# Altium schematic sheet SolarConnectors.SchDoc
size A; SheetNumber: 9; SheetTotal: 10
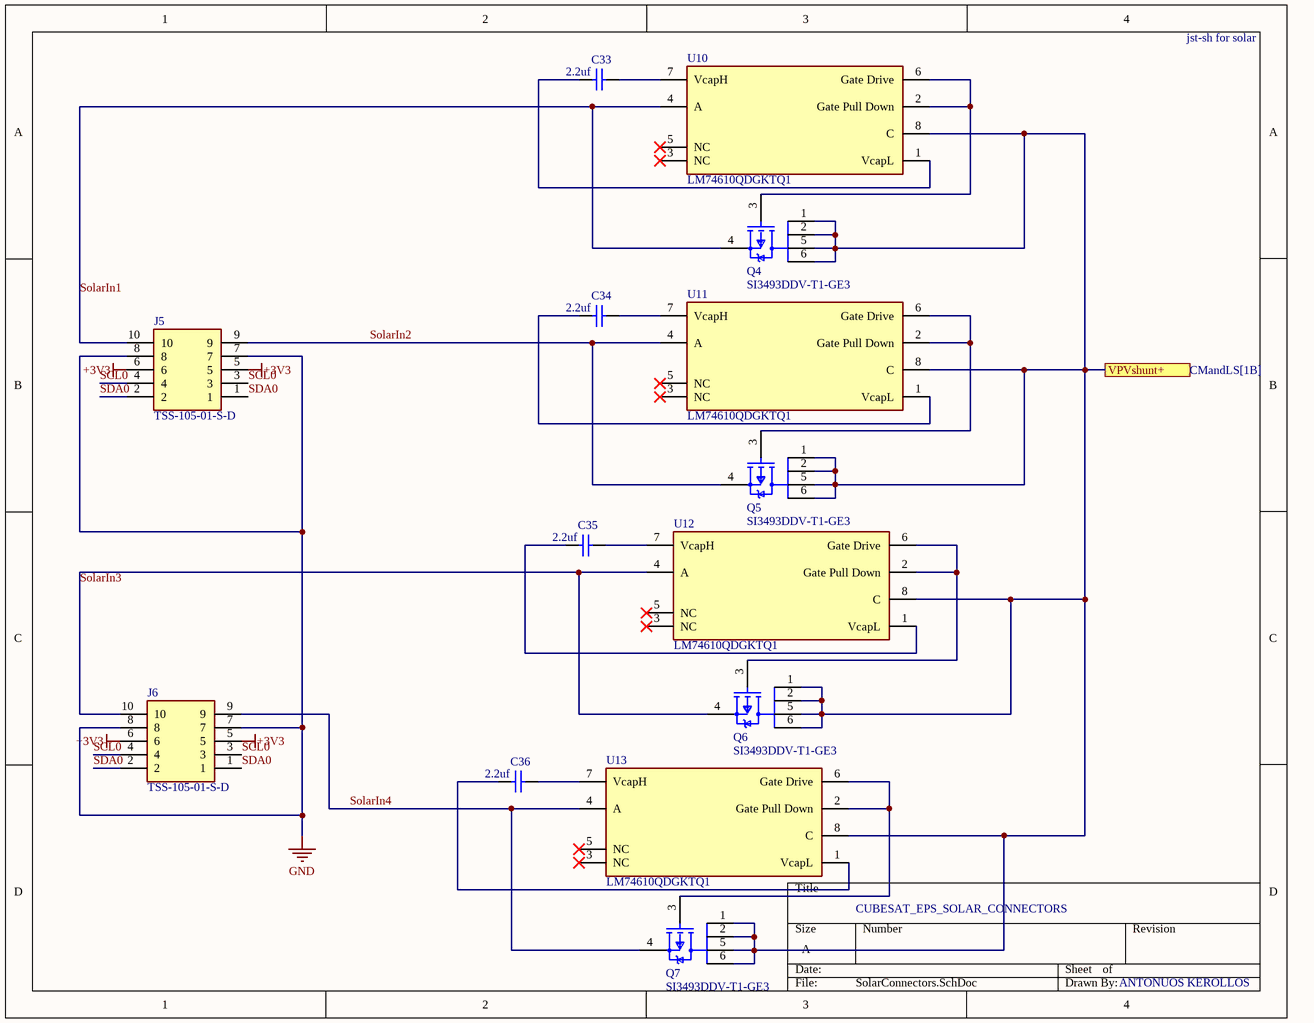
[diagram p0: SolarConnectors.SchDoc]

## Parts
C33  2.2uf  [CAPC2013X145X50ML20T25]
C34  2.2uf  [CAPC2013X145X50ML20T25]
C35  2.2uf  [CAPC2013X145X50ML20T25]
C36  2.2uf  [CAPC2013X145X50ML20T25]
J5  TSS-105-01-S-D  [TSS-105-XX-YYY-D]
J6  TSS-105-01-S-D  [TSS-105-XX-YYY-D]
Q4  SI3493DDV-T1-GE3  [FP-C-06593-MFG]
Q5  SI3493DDV-T1-GE3  [FP-C-06593-MFG]
Q6  SI3493DDV-T1-GE3  [FP-C-06593-MFG]
Q7  SI3493DDV-T1-GE3  [FP-C-06593-MFG]
U10  LM74610QDGKTQ1  [FP-DGK0008A-MFG]
U11  LM74610QDGKTQ1  [FP-DGK0008A-MFG]
U12  LM74610QDGKTQ1  [FP-DGK0008A-MFG]
U13  LM74610QDGKTQ1  [FP-DGK0008A-MFG]

## Ports
VPVshunt+ (see CMandLS[1B])

## Nets
+3V3: J5.5 J5.6 J6.5 J6.6
GND: J5.7 J5.8 J6.7 J6.8
SCL0: J5.3 J5.4 J6.3 J6.4
SDA0: J5.1 J5.2 J6.1 J6.2
SolarIn1: J5.10 Q4.4(S) U10.4(A)
SolarIn2: J5.9 Q5.4(S) U11.4(A)
SolarIn3: J6.10 Q6.4(S) U12.4(A)
SolarIn4: J6.9 Q7.4(S) U13.4(A)
VPVshunt+: Q4.1(D) Q4.2(D) Q4.5(D) Q4.6(D) Q5.1(D) Q5.2(D) Q5.5(D) Q5.6(D) Q6.1(D) Q6.2(D) Q6.5(D) Q6.6(D) Q7.1(D) Q7.2(D) Q7.5(D) Q7.6(D) U10.8(C) U11.8(C) U12.8(C) U13.8(C) ; port VPVshunt+
NetC33_1: C33.1 U10.7(VcapH)
NetC33_2: C33.2 U10.1(VcapL)
NetC34_1: C34.1 U11.7(VcapH)
NetC34_2: C34.2 U11.1(VcapL)
NetC35_1: C35.1 U12.7(VcapH)
NetC35_2: C35.2 U12.1(VcapL)
NetC36_1: C36.1 U13.7(VcapH)
NetC36_2: C36.2 U13.1(VcapL)
NetQ4_3: Q4.3(G) U10.2(Gate_Pull_Down) U10.6(Gate_Drive)
NetQ5_3: Q5.3(G) U11.2(Gate_Pull_Down) U11.6(Gate_Drive)
NetQ6_3: Q6.3(G) U12.2(Gate_Pull_Down) U12.6(Gate_Drive)
NetQ7_3: Q7.3(G) U13.2(Gate_Pull_Down) U13.6(Gate_Drive)

Not connected (* = marked no-connect by the designer): U10 3(NC)* 5(NC)*; U11 3(NC)* 5(NC)*; U12 3(NC)* 5(NC)*; U13 3(NC)* 5(NC)*

## Notes on the sheet
- jst-sh for solar
- (near U13) CUBESAT_EPS_SOLAR_CONNECTORS
- ANTONUOS KEROLLOS

## Library data of the parts
C33-C36 = CMP-1036-04819-2: Part Number: C0805C225K9PACTU; Manufacturer: Kemet
J5 J6 = TSS-105-01-S-D: Connector; Manufacturer_Name: SAMTEC; Datasheet Link: http://suddendocs.samtec.com/prints/tss-1xx-xx-xxx-x-xx-xx-mkt.pdf; Manufacturer_Part_Number: TSS-105-01-S-D; Mouser Part Number: 200-TSS10501SD; Mouser Price/Stock: https://www.mouser.com/Search/Refine.aspx?Keyword=200-TSS10501SD; Arrow Part Number: TSS-105-01-S-D; Arrow Price/Stock: https://www.arrow.com/en/products/tss-105-01-s-d/samtec
Q4-Q7 = CMP-02550-000156-1: MOSFET P-CHANNEL 20V 8A 6TSOP; Manufacturer: Vishay; Rthja Max: 62.5°C/W; Number Of Channels: 1; Reverse Recovery Time: 21ns; Max Forward Diode Voltage: -1.2V; Threshold Vgs Min: -0.4V; Turn Off Delay Time: 95ns; Input Capacitace At Vds: 1825pF @ -10V; Typ Forward Diode Voltage: -0.8V; Threshold Vgs Max: -1V; Continuous Drain Current: -7.5A; Gate Charge At Vgs: 34.8nC @ -8V; Depletion Mode: False; Drain To Source Breakdown Voltage: -20V; Pulse Drain Current: -32A; Reverse Recovery Charge: 34.8nC; Transconductance: 30S; Max Junction Temp: +150°C; Standoff Height: 0.01mm; Drain To Source Resistance: 0.02Ω; Power Dissipation: 2W; Turn On Delay Time: 25ns; Gate To Source Voltage: 8V; Device Class L2: Transistors; Footprint Url: https://www.vishay.com/docs/71200/71200.pdf; Category: Trans; Automotive: No; Digikey Description: MOSFET P-CHANNEL 20V 8A 6TSOP; Manufacturer Part Number: SI3493DDV-T1-GE3; Lead Free: Yes; Octopart: https://octopart.com/si3493ddv-t1-ge3-vishay-81014282; Temperature: -55°C to +150°C; ComponentLink2Description: Datasheet; Device Class L1: Discrete Semiconductors; Temperature Range High: +150°C; RoHS: TRUE; Number Of P Channels: 1; Device Class L3: MOSFETs; Height: 1.1mm; Temperature Range Low: -55°C; Package: C-06593; ComponentLink2URL: https://www.vishay.com/docs/74735/si3493ddv.pdf; Drain To Source Voltage: -20V
U10-U13 = CMP-04910-000005-1: IC SMART DIODE CTLR 8VSSOP; Manufacturer: Texas Instruments; Number Of Outputs: 1; Max Supply Voltage: 42V; Nominal Supply Current: 0uA; Min Supply Voltage: 0.48V; Automotive Grade: Grade 1; Standoff Height: 0.05mm; RoHS: TRUE; Temperature: -40°C to +125°C; Digikey Description: IC SMART DIODE CTLR 8VSSOP; Package: DGK0008A; Automotive: Yes; Device Class L3: unset; Manufacturer Part Number: LM74610QDGKTQ1; Category: IC; Device Class L1: Integrated Circuits (ICs); ComponentLink2URL: http://www.ti.com/lit/ds/symlink/lm74610-q1.pdf; ComponentLink2Description: Datasheet; Temperature Range Low: -40°C; Temperature Range High: +125°C; Device Class L2: Power Management ICs; Octopart: https://octopart.com/lm74610qdgktq1-texas+instruments-61765970; Ambient Temperature Range High: +125°C; Height: 1.1mm; Lead Free: Yes; Ambient Temperature Range Low: -40°C